# EAGLE board Domino Qi Mini (EAGLE 6.5.0)
DATE: 20150428; DRAWN: M.STEMPIN; REV: E
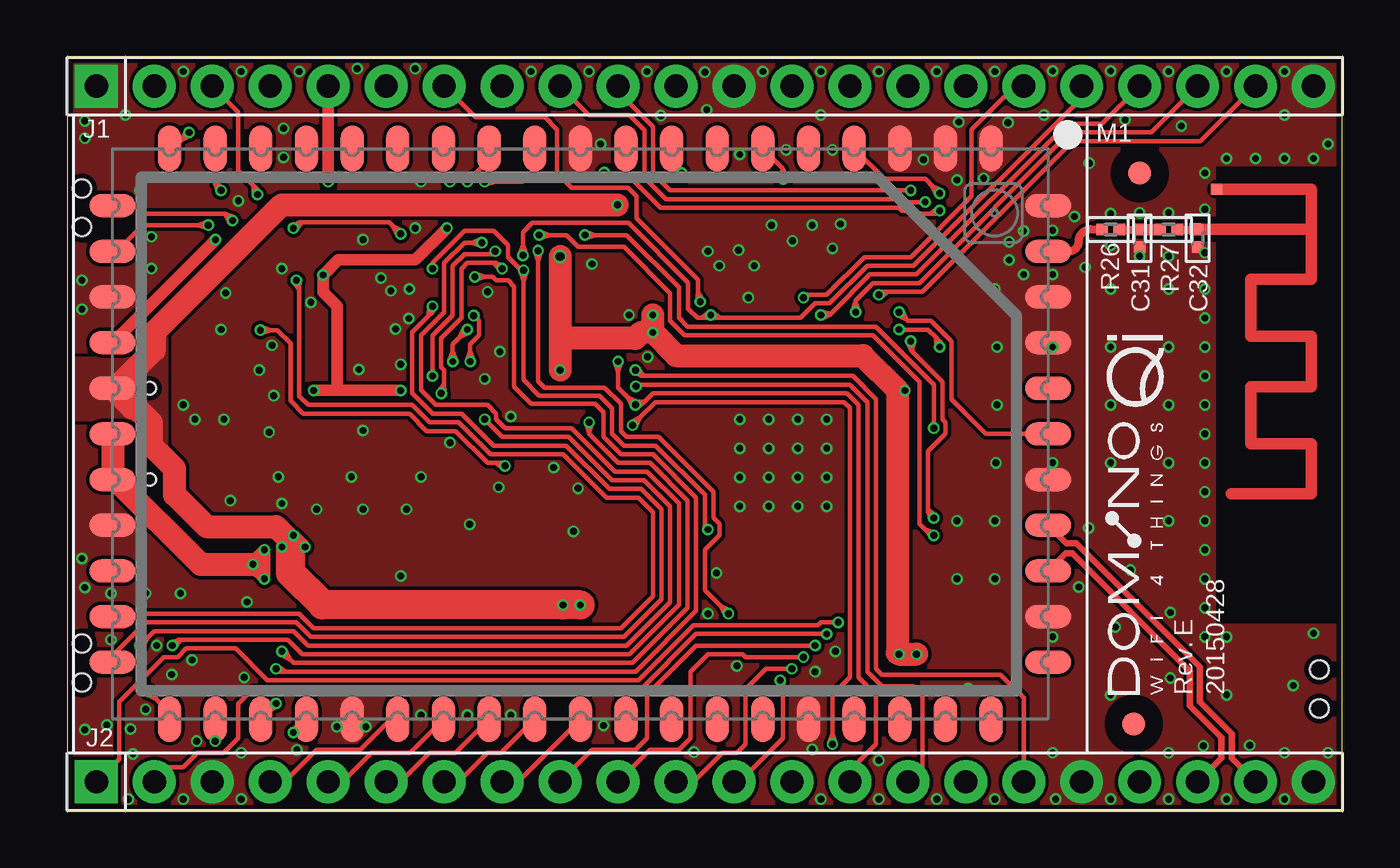
[diagram p1: board, top side]
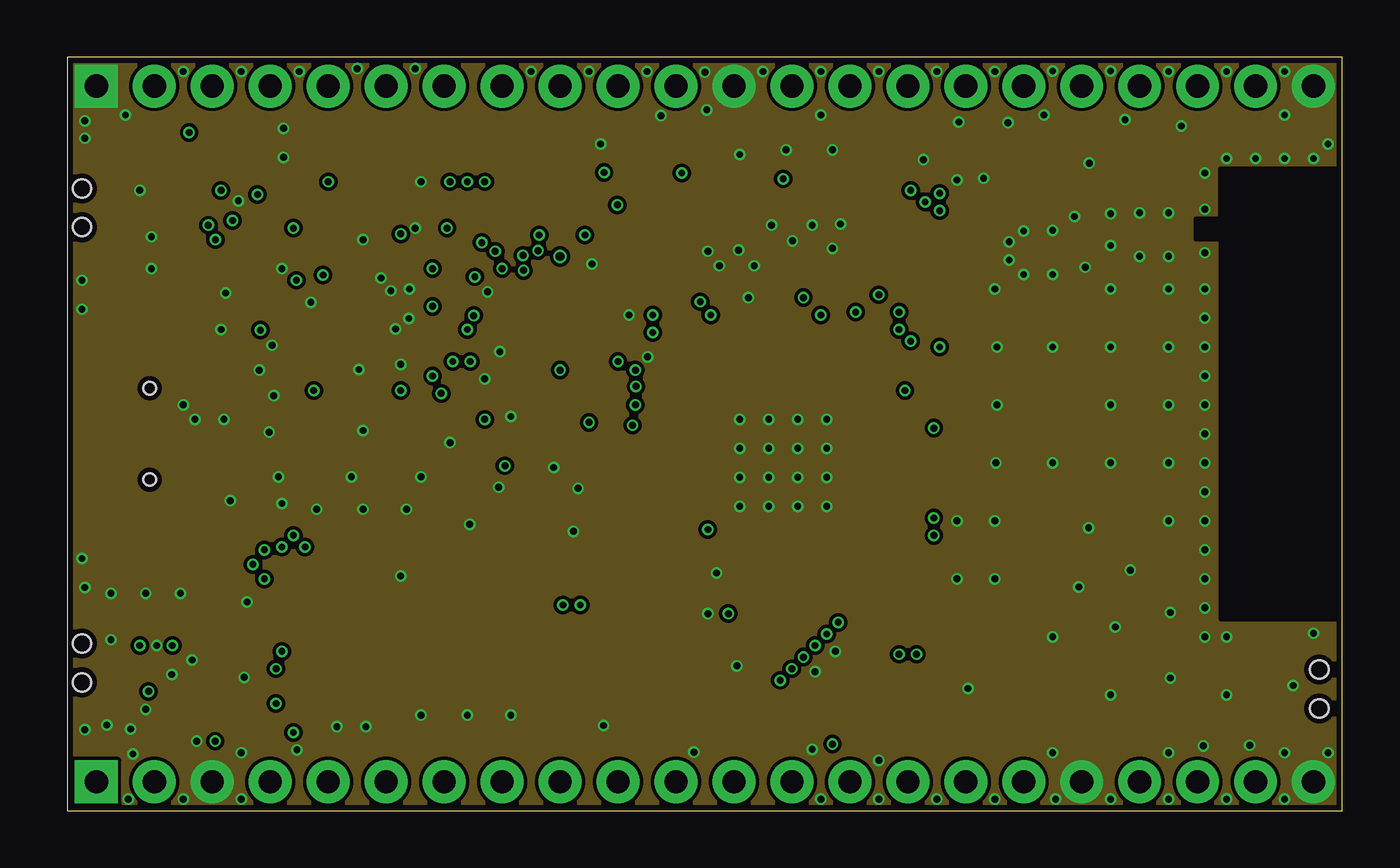
[diagram p2: board, inner layer Route2]
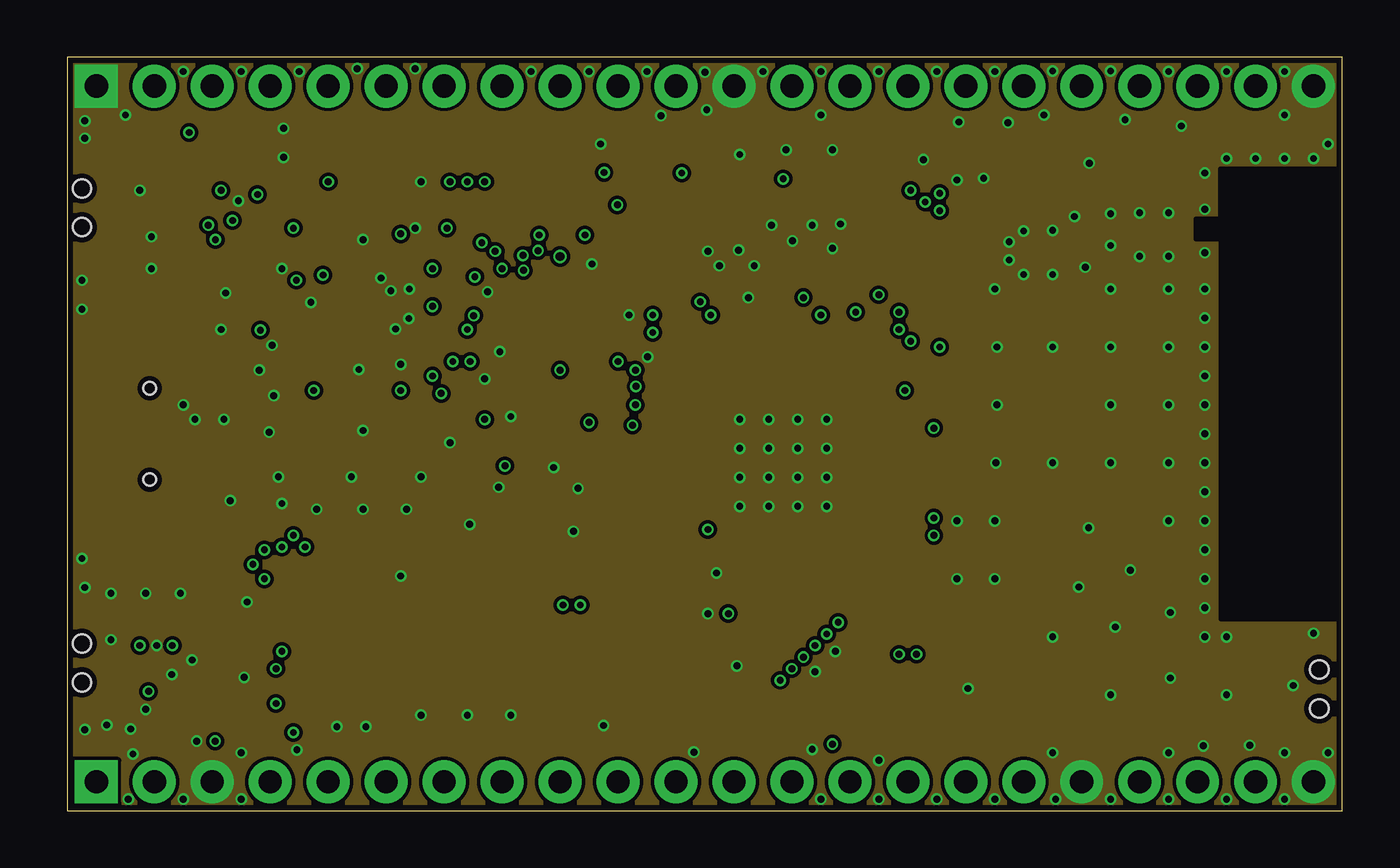
[diagram p3: board, inner layer Route15]
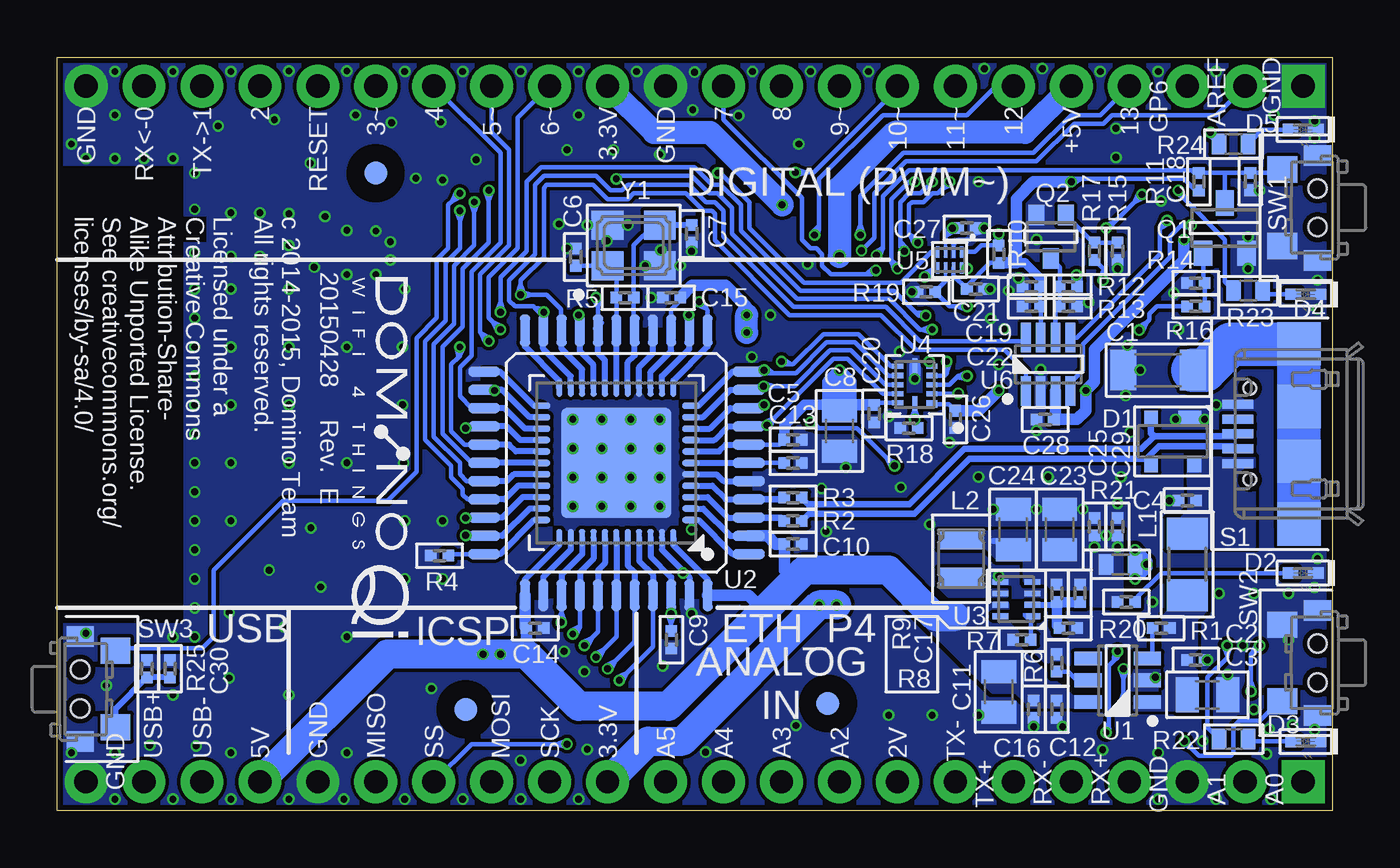
[diagram p4: board, bottom side, seen from below]

Size 55.88 x 33.02 mm. Coordinates in mm from the lower left corner, seen from the top.
Outline: 0,0 55.88,0 55.88,33.02 0,33.02 0,0
Copper layers (1+2*15+16): Top 0.043mm / dielectric 0.3mm / Route2 0.035mm / dielectric 0.71mm / Route15 0.035mm / dielectric 0.3mm / Bottom 0.043mm
Design rules "Domino4 *": minimum track width 0.1mm, minimum drill 0.3mm, track to track 6mil, track to pad 6mil, pad to pad 6mil, via to via 6mil, smd to smd 0mil, copper to edge 0.25mm, drill to drill 0.35mm, minimum pad ring 0.085mm, minimum via ring 0.1mm, stop-mask expansion 0mil, vias tented up to drill 0.45mm, thermal gap 0.2mm
Net classes: 1 USB: width 0.279 mm, clearance 0.152 mm to class 0, clearance 0.152 mm; 2 RF: width 0.356 mm, clearance 0.152 mm; 3 Ethernet: width 0.203 mm, clearance 0.152 mm to class 0, clearance 0.152 mm to class 1, clearance 0.152 mm to class 2, clearance 0.152 mm

## Footprints (pad centres in the part's own frame; a part is rotated, then mirrored left to right if it is on the bottom)
RF_ANT1 = smd 0.5 x 0.5: FEED 1.75,-0.44; GND 0,0.5
C1206 = smd 1.143 x 1.778: 1 -1.524,0; 2 1.524,0
C0402 = smd 0.508 x 0.508: 1 -0.381,0; 2 0.381,0
C0805 = smd 1.016 x 1.524: 1 -0.889,0; 2 0.889,0
SOT143B = smd 1 x 0.7: 1 -0.75,-1 | smd 0.6 x 0.7: 2 0.95,-1; 3 0.95,1; 4 -0.95,1
LED0402 = smd 0.7 x 0.5: 1 -0.55,0; 2 0.55,0
FIDUCIAL = smd 1.016 x 1.016: 1 0,0
MH22-1-0.1 = drill 1.016 pad 1.88 square: 1 0,0 | drill 1.016 pad 1.88: 2 2.54,0; 3 5.08,0; 4 7.62,0; 5 10.16,0; 6 12.7,0; 7 15.24,0; 8 17.78,0; 9 20.32,0; 10 22.86,0; 11 25.4,0; 12 27.94,0; 13 30.48,0; 14 33.02,0; 15 35.56,0; 16 38.1,0; 17 40.64,0; 18 43.18,0; 19 45.72,0; 20 48.26,0; 21 50.8,0; 22 53.34,0
FB1206 = smd 1.4 x 1.8: 1 -1.35,0; 2 1.35,0
SWPA252012S = smd 2 x 0.85: 1 0,0.825; 2 0,-0.825
DOMINO = smd 2 x 1: 1 -12.5,18; 2 -12.5,16; 3 -12.5,14; 4 -12.5,12; 5 -12.5,10; 6 -12.5,8; 7 -12.5,6; 8 -12.5,4; 9 -12.5,2; 10 -12.5,0; 11 -12.5,-2; 12 -12.5,-4; 13 -12.5,-6; 14 -12.5,-8; 15 -12.5,-10; 16 -12.5,-12; 17 -12.5,-14; 18 -12.5,-16; 19 -12.5,-18; 31 12.5,-18; 32 12.5,-16; 33 12.5,-14; 34 12.5,-12; 35 12.5,-10; 36 12.5,-8; 37 12.5,-6; 38 12.5,-4; 39 12.5,-2; 40 12.5,0; 41 12.5,2; 42 12.5,4; 43 12.5,6; 44 12.5,8; 45 12.5,10; 46 12.5,12; 47 12.5,14; 48 12.5,16; 49 12.5,18 | smd 1 x 2: 20 -10,-20.5; 21 -8,-20.5; 22 -6,-20.5; 23 -4,-20.5; 24 -2,-20.5; 25 0,-20.5; 26 2,-20.5; 27 4,-20.5; 28 6,-20.5; 29 8,-20.5; 30 10,-20.5; 50 10,20.5; 51 8,20.5; 52 6,20.5; 53 4,20.5; 54 2,20.5; 55 0,20.5; 56 -2,20.5; 57 -4,20.5; 58 -6,20.5; 59 -8,20.5; 60 -10,20.5
SOT23-3 = smd 0.8 x 1.1: 1 -0.95,-1.1; 2 0.95,-1.1; 3 0,1.1
SOT323 = smd 0.7 x 0.9: 1 -0.65,-0.95; 2 0.65,-0.95; 3 0,0.95
R0402 = smd 0.508 x 0.508: 1 -0.381,0; 2 0.381,0
R0603 = smd 0.635 x 0.889: 1 -0.635,0; 2 0.635,0
USB-MR5-001 = smd 0.4 x 1.35: 1 -1.3,2.675; 2 -0.65,2.675; 3 0,2.675; 4 0.65,2.675; 5 1.3,2.675 | smd 1.9 x 1.9: SH$1 -3.95,0; SH$2 -1.2,0; SH$3 1.2,0; SH$4 3.95,0 | hole 0.55: -2,2.15; 2,2.15
IT-1210 = smd 1.15 x 1.3: 1 -1.675,-1.55; 2 1.675,-1.55 | smd 0.9 x 1.2: SH$1 -2.3,0; SH$2 2.3,0 | hole 0.8: -0.85,0; 0.85,0
SOT23-6 = smd 0.6 x 1.2: 1 -0.95,-1.3; 2 0,-1.3; 3 0.95,-1.3; 4 0.95,1.3; 5 0,1.3; 6 -0.95,1.3
ATMEGA32U4_DUAL_FOOTPRINT = smd 1.4 x 0.45: 1A -5.8,4; 2A -5.8,3.2; 3A -5.8,2.4; 4A -5.8,1.6; 5A -5.8,0.8; 6A -5.8,0; 7A -5.8,-0.8; 8A -5.8,-1.6; 9A -5.8,-2.4; 10A -5.8,-3.2; 11A -5.8,-4; 23A 5.8,-4; 24A 5.8,-3.2; 25A 5.8,-2.4; 26 5.8,-1.6; 27A 5.8,-0.8; 28A 5.8,0; 29A 5.8,0.8; 30A 5.8,1.6; 31A 5.8,2.4; 32A 5.8,3.2; 33A 5.8,4 | smd 0.75 x 0.275: 1M -3.275,2.5; 2M -3.275,2; 3M -3.275,1.5; 4M -3.275,1; 5M -3.275,0.5; 6M -3.275,0; 7M -3.275,-0.5; 8M -3.275,-1; 9M -3.275,-1.5; 10M -3.275,-2; 11M -3.275,-2.5; 23M 3.275,-2.5; 24M 3.275,-2; 25M 3.275,-1.5; 26M 3.275,-1; 27M 3.275,-0.5; 28M 3.275,0; 29M 3.275,0.5; 30M 3.275,1; 31M 3.275,1.5; 32M 3.275,2; 33M 3.275,2.5 | smd 0.45 x 1.4: 12A -4,-5.8; 13A -3.2,-5.8; 14A -2.4,-5.8; 15A -1.6,-5.8; 16A -0.8,-5.8; 17A 0,-5.8; 18A 0.8,-5.8; 19A 1.6,-5.8; 20A 2.4,-5.8; 21A 3.2,-5.8; 22A 4,-5.8; 34A 4,5.8; 35A 3.2,5.8; 36A 2.4,5.8; 37A 1.6,5.8; 38A 0.8,5.8; 39A 0,5.8; 40A -0.8,5.8; 41A -1.6,5.8; 42A -2.4,5.8; 43A -3.2,5.8; 44A -4,5.8 | smd 0.275 x 0.75: 12M -2.5,-3.275; 13M -2,-3.275; 14M -1.5,-3.275; 15M -1,-3.275; 16M -0.5,-3.275; 17M 0,-3.275; 18M 0.5,-3.275; 19M 1,-3.275; 20M 1.5,-3.275; 21M 2,-3.275; 22M 2.5,-3.275; 34M 2.5,3.275; 35M 2,3.275; 36M 1.5,3.275; 37M 1,3.275; 38M 0.5,3.275; 39M 0,3.275; 40M -0.5,3.275; 41M -1,3.275; 42M -1.5,3.275; 43M -2,3.275; 44M -2.5,3.275 | smd 4.826 x 4.826: PAD 0,0
QFN-8_2X1.5 = smd 0.6 x 0.25: 1 -0.75,0.75 | smd 0.7 x 0.25: 2 -0.7,0.25; 3 -0.7,-0.25; 4 -0.7,-0.75; 5 0.7,-0.75; 6 0.7,-0.25; 7 0.7,0.25; 8 0.7,0.75
XQFN-12 = smd 0.5 x 0.32: 1 -0.75,0.85 | smd 0.5 x 0.22: 2 -0.75,0.4; 3 -0.75,0; 4 -0.75,-0.4; 5 -0.75,-0.8; 7 0.75,-0.8; 8 0.75,-0.4; 9 0.75,0; 10 0.75,0.4; 11 0.75,0.8 | smd 0.22 x 0.65: 6 0,-0.825; 12 0,0.825
SOT1089 = smd 0.15 x 0.5: 1 -0.525,-0.35; 2 -0.175,-0.35; 3 0.175,-0.35; 4 0.525,-0.35; 5 0.525,0.35; 6 0.175,0.35; 7 -0.175,0.35; 8 -0.525,0.35
SOT23-8 = smd 0.42 x 1.3: 1 -0.975,-1.175; 2 -0.325,-1.175; 3 0.325,-1.175; 4 0.975,-1.175; 5 0.975,1.175; 6 0.325,1.175; 7 -0.325,1.175; 8 -0.975,1.175
CRYSTAL_32X25 = smd 1.27 x 1.397: 1 -0.889,1.143; 2 -0.889,-1.143; 3 0.889,-1.143; 4 0.889,1.143

## Placement (x,y rotation side)
A1  RF_ANT1  [RF_ANT1]  49.86,27.23 270 top
C1  1n  [C1206]  7.62,19.3 180 bottom
C2  100n  [C0402]  5.97,6.6 0 bottom
C3  4u7  [C0805]  5.46,5.08 0 bottom
C4  10n  [C0402]  6.35,13.59 180 bottom
C5  10u  [C0402]  23.62,16.26 0 bottom
C6  20p  [C0402]  33.15,24.26 270 bottom
C7  20p  [C0402]  28.07,25.27 90 bottom
C8  2u2  [C0805]  21.59,16.64 270 bottom
C9  100n  [C0402]  28.96,7.49 270 bottom
C10  100n  [C0402]  23.62,11.68 0 bottom
C11  22u  [C0805]  14.61,5.21 270 bottom
C12  10p  [C0402]  12.06,4.45 270 bottom
C13  1u  [C0402]  23.62,15.24 180 bottom
C14  100n  [C0402]  34.92,8 0 bottom
C15  100n  [C0402]  28.96,22.48 180 bottom
C16  100n  [C0402]  13.08,4.45 270 bottom
C17  22p  [C0402]  11.05,9.53 90 bottom
C18  100n  [C0402]  3.58,27.57 270 bottom
C19  1u  [C0402]  13.18,22.96 0 bottom
C20  100n  [C0402]  20.07,17.4 270 bottom
C21  100n  [C0402]  15.62,22.86 0 bottom
C22  100n  [C0402]  13.18,22.1 180 bottom
C23  22u  [C0805]  11.94,12.32 90 bottom
C24  22u  [C0805]  13.97,12.32 90 bottom
C25  10p  [C0402]  10.41,12.45 90 bottom
C26  100n  [C0402]  16.51,17.14 270 bottom
C27  100n  [C0402]  16,25.53 0 bottom
C28  100n  [C0402]  12.57,17.14 180 bottom
C29  100n  [C0402]  9.4,12.45 90 bottom
C30  10n  [C0402]  50.93,6.22 90 bottom
C31  DNP  [C0402]  46.99,25.08 270 top
C32  DNP  [C0402]  49.53,25.08 270 top
CC-BY-SA  CC-BY-SA_LOGO  [CC-BY-SA_LOGO]  10.16,-49.53 0 top  (outside the outline)
D1  PRTR5V0U2X  [SOT143B]  6.99,16.18 180 bottom
D2  GREEN  [LED0402]  1.27,10.41 180 bottom
D3  YELLOW  [LED0402]  1.15,3.04 180 bottom
D4  WHITE  [LED0402]  1.15,22.63 180 bottom
D5  BLUE  [LED0402]  1.27,29.84 180 bottom
DRILEGEND  [DRILEGEND]  96.77,62.48 0 top  (outside the outline)
F1  FIDUCIAL  [FIDUCIAL]  22.1,4.7 180 bottom
F2  FIDUCIAL  [FIDUCIAL]  46.74,3.81 0 top
F3  FIDUCIAL  [FIDUCIAL]  46.99,27.94 0 top
F4  FIDUCIAL  [FIDUCIAL]  37.97,4.45 0 bottom
F5  FIDUCIAL  [FIDUCIAL]  41.91,27.94 0 bottom
J1  MH22-1  [MH22-1-0.1]  1.27,31.75 0 top
J2  MH22-1  [MH22-1-0.1]  1.27,1.27 0 top
L1  BLM31PG601SN1L  [FB1206]  6.35,10.79 90 bottom
L2  SWPA252012S1R0NT  [SWPA252012S]  16.26,11.05 180 bottom
M1  DOMINO  [DOMINO]  22.48,16.51 270 top
Q1  AP2302GN  [SOT23-3]  4.7,25.53 0 bottom
Q2  2SC4081  [SOT323]  12.32,25.15 180 bottom
R1  100k  [R0402]  7.49,8 0 bottom
R2  22R  [R0402]  23.62,12.7 180 bottom
R3  22R  [R0402]  23.62,13.72 180 bottom
R4  10k  [R0402]  39.12,11.18 0 bottom
R5  1M  [R0402]  30.99,22.48 180 bottom
R6  15k  [R0402]  12.06,6.48 90 bottom
R7  10k  [R0402]  13.59,7.49 0 bottom
R8  33k2  [R0402]  11.56,8 180 bottom
R9  150k  [R0402]  12.06,9.53 270 bottom
R10  10k  [R0402]  14.61,24.38 270 bottom
R11  4k7  [R0402]  5.84,27.56 90 bottom
R12  10k  [R0402]  11.56,22.96 0 bottom
R13  10k  [R0402]  11.56,22.1 0 bottom
R14  4k7  [R0402]  5.97,23.11 180 bottom
R15  47k  [R0402]  9.4,24.51 270 bottom
R16  1k  [R0402]  5.97,22.1 0 bottom
R17  47k  [R0402]  10.41,24.51 270 bottom
R18  10k  [R0402]  18.54,16.76 0 bottom
R19  10k  [R0402]  17.78,22.73 0 bottom
R20  270R  [R0402]  9.02,9.14 180 bottom
R21  0R  [R0603]  9.27,10.79 0 bottom
R22  330R  [R0603]  4.31,3.14 180 bottom
R23  330R  [R0603]  3.67,22.79 180 bottom
R24  270R  [R0603]  4.32,29.21 180 bottom
R25  10k  [R0402]  51.94,6.22 270 bottom
R26  0R  [R0402]  45.72,25.46 0 top
R27  0R  [R0402]  48.26,25.46 0 top
S1  USB_MR5-001  [USB-MR5-001]  1.45,16.51 90 bottom
SW1  IT-1210  [IT-1210]  0.64,26.42 270 bottom
SW2  IT-1210  [IT-1210]  0.64,6.48 270 bottom
SW3  IT-1210  [IT-1210]  54.86,5.33 90 bottom
U1  MP65151DJ  [SOT23-6]  9.4,5.71 90 bottom
U2  ATMEGA32U4-AU/MU  [ATMEGA32U4_DUAL_FOOTPRINT]  31.37,15.24 180 bottom
U3  MP2162GQH  [QFN-8_2X1.5]  13.84,9.27 180 bottom
U4  NTB0104GU12  [XQFN-12]  18.29,18.67 180 bottom
U5  NTB0102GF  [SOT1089]  16.76,24.13 180 bottom
U6  MAX3375EEKA+T  [SOT23-8]  12.45,19.56 0 bottom
U$3  [DOMINO_QI_LOGO_SMALL]  46.99,5.08 90 top
U$5  [DOMINO_QI_LOGO_SMALL]  41.91,23.37 270 bottom
U$28  [A5L-LOC]  -40.64,-60.96 0 top  (outside the outline)
W1  DOMINO_QI_LOGO  [DOMINO_QI_LOGO]  -34.29,-46.99 0 top  (outside the outline)
Y1  16MHz  [CRYSTAL_32X25]  30.61,24.77 90 bottom

## Tracks (layer width: path | path; a pad name or v marks a point on that pad's centre or on a via)
!RESET  (via drill 0.3)
  Top 0.203: J1.18 44.45,31.24 37.08,23.88 35.05,23.88 33.4,22.23 32.77,22.23 32.13,21.59 28.63,21.59 | 28.63,21.59 28.32,21.59 v28.19,21.72 | v19.96,24.33 19.96,24.78 | 19.96,24.78 19.96,25.35 20.37,25.76 24.59,25.76 27.2,23.14 27.2,22 27.61,21.59 27.76,21.59 | 27.76,21.59 28.07,21.59 v28.19,21.72 | 28.63,21.59 28.28,21.84 v28.19,21.72 | 28.63,21.59 28.2,21.57 v28.19,21.72 | 27.76,21.59 28.19,21.57 v28.19,21.72 | 27.76,21.59 28.11,21.84 v28.19,21.72 | 19.96,24.78 19.82,24.38 v19.96,24.33 | 19.96,24.78 20.1,24.38 v19.96,24.33
  Bottom 0.203: 4.7,27.95 C18.1 2.33,27.95 SW1.1 | 4.7,27.95 R11.2 6.02,27.94 6.15,28.07 18.54,28.07 19.68,26.92 19.68,24.69 | Q1.3 4.7,27.95 | 19.68,24.69 19.68,24.61 v19.96,24.33 | U2.13A 28.17,21.27 | 28.17,21.27 28.17,21.69 v28.19,21.72 | 28.17,21.27 28.33,21.66 v28.19,21.72 | 28.17,21.27 28.05,21.68 v28.19,21.72 | 19.68,24.69 19.82,24.29 v19.96,24.33 | 19.68,24.69 20.04,24.46 v19.96,24.33
!RESET_L  (via drill 0.3)
  Top 0.203: 37.91,27.37 37.59,27.69 35.8,27.69 M1.4 | 37.91,27.37 v38.23,27.05 | 37.91,27.37 38.09,26.99 v38.23,27.05 | 37.91,27.37 38.29,27.18 v38.23,27.05
  Bottom 0.203: SW3.2 53.21,7.11 49.53,7.11 49.02,7.62 49.02,10.54 45.97,13.59 41.4,13.59 40.13,14.86 40.13,20.7 39.24,21.59 39.24,24.13 38.73,24.64 38.73,26.54 38.55,26.73 | v38.23,27.05 38.55,26.73 | 38.55,26.73 38.36,27.11 v38.23,27.05 | 38.55,26.73 38.16,26.92 v38.23,27.05
!UART_EN
  Bottom 0.203: Q2.3 11.94,23.82 R12.1 R13.1 12.12,21.91 U6.6
+2V5  (via drill 0.3)
  Top 0.508: M1.23 v6.49,25.02 | 11.81,18.41 11.81,22.1 11.2,22.71 v11.2,23.47 11.86,24.13 15.24,24.13 v16.64,25.53 | 11.81,18.41 v14.61,18.41 | 11.81,18.41 v10.79,18.41
  Bottom 0.152: U5.3 16.94,24.97
  Bottom 0.203: U4.1 16.8,17.82 C26.1 | v16.64,25.53 16.94,25.23 16.94,25.19 | v16.64,25.53 C27.1 | 16.94,24.97 16.94,25.19 | 16.94,25.19 16.77,25.59 v16.64,25.53 | 16.94,25.19 16.57,25.4 v16.64,25.53
  Bottom 0.508: v6.49,25.02 6.49,24.12 10.41,20.19 10.41,18.8 v10.79,18.41 10.79,17.53 11.18,17.14 12.12,17.14 12.12,17.22 | U6.3 12.12,17.22 | 12.12,17.22 C28.1 | v14.61,18.41 15.49,17.53 C26.1 | R12.2 11.18,23.44 v11.2,23.47
+2VA_ETH_OUT
  Top 0.203: M1.40 19.74,1.27 J2.8
+3.3VD_IN  (via drill 0.3)
  Top 0.508: v8.13,10.79 8.13,10.92 v8.64,11.43 v8.64,10.16 8.13,10.67 v8.13,10.79
  Top 1.016: M1.25 M1.26 | M1.26 1.68,14.51 | M1.26 2.13,14.51 5.84,10.79 v8.13,10.79
  Bottom 0.508: v8.64,11.43 R21.2 v8.64,10.16 8.13,10.67 v8.13,10.79 8.13,10.92 v8.64,11.43
+3V3  (via drill 0.3)
  Top 0.508: v9.4,11.56 9.78,11.56 v10.41,11.56 v9.91,12.06 9.72,11.87 v9.4,11.56
  Top 0.762: M1.24 2.13,18.51
  Top 1.016: M1.24 2.84,17.65 3.02,17.65 3.68,16.99 3.68,16 4.7,14.99 4.7,13.84 6.1,12.45 9.14,12.45 9.72,11.87 | 2.13,18.51 3.81,20.19 3.81,20.95 9.4,26.54 v24.11,26.54
  Top 1.27: v22.48,9.02 v21.72,9.02 11.18,9.02 9.78,10.41 9.78,11.56
  Bottom 0.254: C24.1 14.22,11.68 14.48,11.68 14.61,11.81 14.86,11.81
  Bottom 0.61: 12.06,11.3 C23.1
  Bottom 1.016: J1.13 29.72,29.72 27.25,29.72 24.11,26.57 v24.11,26.54
  Bottom 1.27: J2.13 29.97,3.05 28.45,3.05 v22.48,9.02 v21.72,9.02
  pour Bottom (no thermals): 13.39,10.03 13.39,10.06 13.41,10.06 13.41,11.05 14.63,11.05 15.14,11.56 17.12,11.56 17.12,12.17 15.14,12.17 14.78,12.19 9.27,12.19 9.27,9.02 10.52,9.02 10.52,9.78 12.27,9.78 12.5,10.03
  pour Top (no thermals): 0,19.81 2.92,19.81 3.68,20.7 4.32,20.7 4.32,16 3.3,16 3.3,16.89 3.05,17.14 0,17.14
+5V  (via drill 0.3, 0.38)
  Top 0.508: 36.37,18.44 36.68,18.44 v36.7,18.41 | v11.43,27.56 J1.5
  Top 1.016: v37.21,6.86 v36.45,6.86 36.4,6.91 36.37,6.91 36.37,18.44 | 36.39,18.41 36.37,18.44 | 36.37,18.44 34.87,19.94 26.67,19.94 v25.65,20.95 | v21.59,24.28 21.59,20.83 | 21.59,20.83 v21.59,19.3 | v25.65,20.95 v25.65,21.72 | v25.65,20.95 25.15,20.95 24.89,20.7 21.72,20.7 21.59,20.83
  Bottom 0.203: 13.84,7.62 R7.1 | U2.14A 28.97,21.96 28.57,22.35 C15.1 | U2.7A 24.22,16.04 C5.1 | U4.11 19.98,17.87 C20.1 | R11.1 5.99,27.18 6.5,27.69 11,27.69 | 12.77,22.93 C19.2 C22.1 12.77,22.07 U6.7 | 11,27.69 11.3,27.69 v11.43,27.56 | R10.2 14.99,24 16,22.99 C21.1 16.59,23.45 U5.7 | 11,27.69 11.34,27.44 v11.43,27.56 | 11,27.69 11.42,27.71 v11.43,27.56
  Bottom 0.254: v36.7,18.41 36.68,18.44 36.37,18.44
  Bottom 0.406: C19.2 12.8,23.34 13.46,24 13.84,24
  Bottom 0.457: 22.1,17.78 23.11,17.78 24,16.89 C5.1
  Bottom 0.508: U2.2A 24.74,12.04 24.38,11.68 C10.1 24,10.54 23.11,10.54 | U2.34A 35.37,8.06 C14.1 35.31,6.86 | U2.44A 25.57,9.44 24.89,8.76 | C20.1 21.08,17.78 21.08,18.8 v21.59,19.3 | v11.43,27.56 13.08,27.56 13.84,26.8 13.84,24 R10.2 | C15.1 28.04,23.01 26.59,23.01 25.65,22.07 v25.65,21.72 | v21.59,19.3 22.1,18.8 22.1,18.03 | 22.1,18.03 21.59,18.03 | 21.59,18.03 v21.59,19.3 | 21.59,18.03 C8.1 | 22.1,18.03 22.1,17.78
  Bottom 1.016: J1.5 13.46,29.72 19.18,29.72 21.59,27.3 v21.59,24.28 | v25.65,20.95 v25.65,21.72
  Bottom 1.27: J2.19 41.4,6.86 v36.45,6.86 35.31,6.86 33.02,4.57 29.08,4.57 24.89,8.76 23.11,10.54 19.43,10.54 17.4,8.51 16.51,8.51
  pour Bottom (no thermals): 13.82,7.24 13.82,7.82 14.22,8.23 14.22,9.04 18.69,9.04 14.86,5.21 13.84,5.21 13.36,4.72 13.36,4.57 10.16,4.57 10.16,4.95 11.18,4.95 11.18,4.98 11.2,4.98 11.33,4.95 12.57,5.99
A0  (via drill 0.3)
  Top 0.203: v33.78,8.26 33.02,8.26 32.89,8.13 27.43,8.13 25.02,5.71 8.76,5.71 7.37,7.11 5.21,7.11 4.83,6.73 4.22,6.73 2.26,4.78 2.26,2.26 J2.1
  Bottom 0.203: v33.78,8.26 33.77,8.27 33.77,8.71 | U2.36A 33.77,8.71 | 33.77,8.71 33.64,8.3 v33.78,8.26 | 33.77,8.71 33.92,8.31 v33.78,8.26
A1  (via drill 0.3)
  Top 0.203: v33.27,7.75 27.56,7.75 25.15,5.33 8.13,5.33 7.49,4.7 7.49,3.17 6.86,2.54 5.71,2.54 5.08,1.91 4.45,1.91 J2.2
  Bottom 0.203: U2.37A 32.97,8.08 | 32.97,8.08 32.97,8.05 v33.27,7.75 | 32.97,8.08 33.14,7.69 v33.27,7.75 | 32.97,8.08 33.34,7.88 v33.27,7.75
A2  (via drill 0.3)
  Top 0.203: v32.77,7.24 27.56,7.24 25.4,5.08 25.4,3.17 24.89,2.67 22.99,2.67 J2.9
  Bottom 0.203: U2.38A 32.17,7.84 32.45,7.56 | 32.45,7.56 v32.77,7.24 | 32.45,7.56 32.63,7.17 v32.77,7.24 | 32.45,7.56 32.83,7.37 v32.77,7.24
A3  (via drill 0.3)
  Top 0.203: v32.26,6.73 29.72,6.73 29.59,6.86 28.07,6.86 27.3,6.1 27.3,3.17 26.8,2.67 25.53,2.67 J2.10
  Bottom 0.203: U2.39A 31.37,7.62 31.94,7.05 | 31.94,7.05 v32.26,6.73 | 31.94,7.05 32.12,6.67 v32.26,6.73 | 31.94,7.05 32.32,6.87 v32.26,6.73
A4  (via drill 0.3)
  Top 0.203: v31.75,6.22 30.61,6.22 29.72,5.33 29.72,2.92 29.34,2.54 28.7,2.54 27.43,1.27 J2.11
  Bottom 0.203: U2.40A 30.57,7.4 31.43,6.54 | 31.43,6.54 v31.75,6.22 | 31.43,6.54 31.62,6.16 v31.75,6.22 | 31.43,6.54 31.81,6.36 v31.75,6.22
A5  (via drill 0.3)
  Top 0.203: 31.37,5.28 31.37,3.17 29.46,1.27 J2.12 | 31.37,5.28 31.37,5.59 v31.24,5.71 | 31.37,5.28 31.39,5.71 v31.24,5.71 | 31.37,5.28 31.12,5.63 v31.24,5.71
  Bottom 0.203: U2.41A 29.77,7.19 30.92,6.03 | 30.92,6.03 v31.24,5.71 | 30.92,6.03 31.11,5.65 v31.24,5.71 | 30.92,6.03 31.31,5.85 v31.24,5.71
ANT0
  Top 0.356: M1.59 43.94,24.51 arc90 44.32,25.02 arc-90 44.9,25.46 R26.1
  Top 0.66: M1.59 42.55,24.51
ANT0_50R
  Top 0.356: R27.2 C32.1
  Top 0.508: C32.1 49.41,25.46 arc90 A1.FEED
ANT0_EXT
  Top 0.356: R26.2 C31.1
  Top 0.508: C31.1 R27.1
AREF  (via drill 0.3)
  Top 0.203: v28.97,8.64 28.65,8.95 | 28.65,8.95 27.94,9.66 27.94,11.43 28.57,12.06 28.57,12.57 28.32,12.83 28.32,13.97 25.91,16.38 24.51,16.38 24.26,16.64 24.26,17.83 23.55,18.54 20.9,18.54 20.62,18.82 20.62,24.09 | v20.62,24.54 20.62,24.09 | 28.65,8.95 28.84,8.57 v28.97,8.64 | 28.65,8.95 29.03,8.77 v28.97,8.64 | 20.62,24.09 20.77,24.49 v20.62,24.54 | 20.62,24.09 20.48,24.49 v20.62,24.54
  Bottom 0.203: v28.97,8.64 28.97,8.19 | 28.97,8.19 28.97,7.89 C9.1 | v28.97,8.64 28.97,9.09 | 28.97,9.09 U2.42A | J1.2 5.08,30.48 9.65,30.48 10.03,30.1 11.3,30.1 12.95,28.45 18.67,28.45 20.07,27.05 20.07,25.09 v20.62,24.54 | 28.97,8.19 29.11,8.59 v28.97,8.64 | 28.97,8.19 28.83,8.59 v28.97,8.64 | 28.97,9.09 28.83,8.69 v28.97,8.64 | 28.97,9.09 29.11,8.69 v28.97,8.64
BLUE_LED
  Bottom 0.203: D5.2 3.05,29.84 R24.1
BLUE_LED1
  Bottom 0.203: D4.2 2.87,22.63 R23.1
BLUE_LED2
  Bottom 0.203: D3.2 3.57,3.04 R22.1
D4
  Bottom 0.203: U2.25A 37.71,17.64 38.23,18.16 38.23,19.43 37.72,19.94 37.72,23.62 36.45,24.89 36.45,28.83 J1.16
D5  (via drill 0.3)
  Top 0.203: v37.97,12.83 37.72,13.08 37.72,13.2 | 37.72,13.2 37.72,15.75 38.48,16.51 38.48,17.02 38.35,17.14 38.35,18.8 37.02,20.13 | 37.02,20.13 36.96,20.19 v36.96,20.57 | 37.02,20.13 37.1,20.55 v36.96,20.57 | 37.02,20.13 36.83,20.51 v36.96,20.57 | 37.72,13.2 37.83,12.79 v37.97,12.83 | 37.72,13.2 38.06,12.95 v37.97,12.83
  Bottom 0.203: v37.97,12.83 37.52,12.83 | 37.52,12.83 37.18,12.83 U2.31A | v36.96,20.57 37.27,20.89 | 37.27,20.89 37.34,20.95 37.34,23.5 36.07,24.77 36.07,28.96 36.83,29.72 J1.15 | 37.27,20.89 36.89,20.71 v36.96,20.57 | 37.27,20.89 37.09,20.51 v36.96,20.57 | 37.52,12.83 37.92,12.69 v37.97,12.83 | 37.52,12.83 37.92,12.97 v37.97,12.83
D6  (via drill 0.3)
  Top 0.203: v38.23,20.32 38.23,20.57 38.06,20.74 | 38.06,20.74 37.72,21.08 v36.45,21.08 | 38.06,20.74 38.08,20.31 v38.23,20.32 | 38.06,20.74 38.34,20.42 v38.23,20.32
  Bottom 0.203: v36.45,21.08 36.77,21.4 | 36.77,21.4 36.96,21.59 36.96,23.37 35.69,24.64 35.69,30.35 J1.14 | U2.27A 38.01,16.04 38.61,16.64 38.61,19.56 38.29,19.88 | 38.29,19.88 38.23,19.94 v38.23,20.32 | 36.77,21.4 36.38,21.22 v36.45,21.08 | 36.77,21.4 36.58,21.02 v36.45,21.08 | 38.29,19.88 38.37,20.29 v38.23,20.32 | 38.29,19.88 38.09,20.25 v38.23,20.32
D+
  Bottom 0.279: R3.1 22.96,13.44 18.52,13.44 16.1,15.85 8.36,15.85 7.8,16.41 | D1.2 7.93,16.55 7.8,16.41 | 4.15,16.48 4.23,16.41 7.8,16.41
  Bottom 0.368: D1.2 7.97,17.18 | 4.15,16.48 S1.3
D-
  Bottom 0.279: R2.1 22.94,13.01 18.31,13.01 15.9,15.42 8.15,15.42 | 7.93,15.33 D1.3 7.93,15.21 8.15,15.42 | 8.15,15.42 7.59,15.98 4.24,15.98 4.15,15.88
  Bottom 0.368: 4.15,15.88 S1.2
EN
  Bottom 0.203: R7.2 13.21,8.41 U3.1
EN_USB
  Bottom 0.203: R1.1 7.87,6.89 U1.3
FB
  Bottom 0.203: 12.19,9.02 R9.2
  Bottom 0.254: U3.2 12.19,9.02
  Bottom 0.457: C17.1 R9.2 12.06,8.13 R8.2
GND  (via drill 0.3)
  Bottom 0.152: U5.2 16.59,24.81
  Bottom 0.203: 30.37,16.24 U2.PAD 32.96,13.65 | 33.37,13.24 v33.27,13.34 | v33.27,13.34 32.96,13.65 | 16.59,24.81 16.38,25.02 15.88,25.02 15.62,25.27 15.62,25.29 | C27.2 15.62,25.29 | 32.96,13.65 33.14,13.27 v33.27,13.34 | 32.96,13.65 33.34,13.47 v33.27,13.34 | 15.62,25.29 15.36,25.62 v15.24,25.53 15.21,25.38 15.62,25.29
  Bottom 0.508: U4.6 v18.29,18.92
  other vias: 45.72,26.16 43.18,25.43 41.91,25.4 41.91,23.5 43.18,23.5 41.27,24.13 41.27,24.92 44.61,23.81 45.72,24.77 46.99,24.29 48.26,24.29 49.85,24.45 49.85,21.59 49.85,20.32 49.85,22.86 49.85,19.05 49.85,17.78 49.85,16.51 49.85,15.24 49.85,13.97 49.85,12.7 49.85,11.43 49.85,10.16 49.85,8.89 49.85,7.62 50.8,7.62 54.61,7.78 55.24,2.54 53.34,2.54 50.8,5.08 48.26,22.86 48.26,20.32 48.26,17.78 48.26,15.24 48.26,12.7 48.34,8.69 45.72,5.08 45.92,8.05 44.75,12.4 45.72,15.24 45.72,17.78 45.72,20.32 45.72,22.86 49.85,27.94 50.8,28.57 52.07,28.57 53.34,28.57 54.61,28.57 55.24,29.21 53.34,30.48 49.85,26.35 48.26,26.19 46.99,26.19 44.13,26.04 8.97,20.4 8.41,19.3 9.04,18.19 2.54,30.48 5.08,17.78 6.73,21.08 7.62,2.54 17.63,12.55 30.86,25.65 33.88,25.7 33.02,30.48 38.99,10.16 38.99,12.7 38.99,27.64 40.64,10.16 40.64,12.7 40.69,15.24 40.74,17.78 40.74,20.32 40.64,22.86 43.18,20.32 43.18,15.24 43.18,7.62 43.18,2.54 48.34,5.82 48.26,2.54 29.46,13.34 30.73,13.34 32,13.34 33.27,14.61 32,14.61 29.46,14.61 29.46,15.88 30.73,15.88 32,15.88 33.27,15.88 33.27,17.14 32,17.14 30.73,17.14 29.46,17.14 29.34,6.35 33.66,6.99 32.77,6.1 15.49,4.19 17.53,4.19 19.43,4.19 1.91,7.49 1.91,9.53 1.73,3.76 0.76,3.56 22.17,12.24 0.76,9.78 0.64,11.05 0.64,23.24 0.64,21.97 3.68,25.15 3.68,23.75 3.17,27.18 0.76,30.23 0.76,29.46 15.24,32.51 12.7,32.51 31.5,28.96 33.53,28.96 37.52,28.52 40.16,27.71 42.8,30.48 46.35,30.28 48.82,30 44.78,28.37 30.48,32.38 33.02,32.38 35.56,32.38 38.1,32.38 48.26,32.38 50.8,32.38 53.34,32.38 22.38,14.12 22.99,23.95 29.84,22.48 28.07,24.51 30.1,23.88 28.57,23.88 33.53,24.64 32.64,25.65 31.78,24.97 18.9,14.17 21.31,15.04 15.49,14.63 12.45,14.63 10.92,13.21 9.4,13.46 9.25,14.63 12.95,13.21 14.86,13.21 14.61,10.29 7.87,9.14 4.95,9.53 3.43,9.53 7.14,13.59 8.84,16.59 6.86,17.14 5.59,17.14 3.43,4.45 2.67,0.51 11.81,3.68 13.08,3.68 33.02,0.51 5.08,0.51 7.62,0.51 35.56,0.51 38.1,0.51 40.64,0.51 43.31,0.51 45.72,0.51 48.26,0.51 50.8,0.51 53.34,0.51 5.46,6.6 7.75,5.84 4.57,5.97 28.45,10.41 28.07,8.64 5.66,3.05 23.37,29.21 12.78,19.33 9.4,23.75 12.95,25.02 10.67,22.28 14.17,22.78 12.95,16.66 13.74,23.34 16.76,16.13 19.43,17.27 14.61,19.56 15.49,27.56 29.41,24.56 18.95,20.12 25.43,19.89 24.61,21.72 6.93,22.68 39.47,5.36 53.72,5.49 46.58,10.54 44.32,9.8 49.78,2.84 51.82,2.87 39.07,30.18 41.22,30.15 29.46,28.75 28.02,30.71 27.94,32.36 43.18,32.41 32.64,2.69 35.56,2.21 27.46,2.57 23.5,3.73 10.06,2.67 3.91,7.24 2.77,3.58 2.87,2.49 7.49,26.72 9.47,28.63 9.47,29.9 25.4,32.38 26.01,30.45 14.96,21.56 14.38,21.11 22.86,32.38 20.32,32.38 10.16,32.38 7.62,32.38 5.08,32.38 40.64,32.38 45.72,32.41 18.41,22.73 14.99,22.86 30.73,14.61
  pour Top (rank 2, no thermals): 0,33.02 55.88,33.02 55.88,0 0,0
  pour Route2 (rank 2, no thermals): 0,33.02 55.88,33.02 55.88,0 0,0
  cutout Route2: 55.73,28.12 50.52,28.12 50.52,25.93 49.45,25.93 49.45,25.04 50.55,25.04 50.55,8.38 55.75,8.38
  pour Route15 (rank 2, no thermals): 0,33.02 55.88,33.02 55.88,0 0,0
  cutout Route15: 55.73,28.12 50.52,28.12 50.52,25.93 49.45,25.93 49.45,25.04 50.55,25.04 50.55,8.38 55.75,8.38
  pour Bottom (rank 2, no thermals): 0,33.02 55.88,33.02 55.88,0 0,0
GP6  (via drill 0.3)
  Top 0.203: J1.3 7.49,30.61 7.49,28.04 8.13,27.4 | v9.91,25.53 10.16,25.78 10.28,25.78 | 10.28,25.78 14.1,25.78 14.29,25.59 | 14.29,25.59 v14.61,25.27 | 8.13,27.4 8.33,27.2 v8.33,27 | 8.13,27.4 8.18,26.98 v8.33,27 | 8.13,27.4 8.44,27.11 v8.33,27 | 10.28,25.78 9.87,25.67 v9.91,25.53 | 10.28,25.78 10.03,25.44 v9.91,25.53 | 14.29,25.59 14.47,25.21 v14.61,25.27 | 14.29,25.59 14.67,25.41 v14.61,25.27
  Bottom 0.152: U5.1 16.23,24.48
  Bottom 0.203: v9.91,25.53 9.8,25.53 9.54,25.79 | 9.54,25.79 8.65,26.68 | 8.65,26.68 v8.33,27 | 14.61,24.82 R10.1 15.37,24.77 15.65,24.48 16.23,24.48 | 14.61,24.82 v14.61,25.27 | 8.65,26.68 8.46,27.07 v8.33,27 | 8.65,26.68 8.27,26.87 v8.33,27 | 9.54,25.79 9.78,25.44 v9.91,25.53 | 9.54,25.79 9.95,25.67 v9.91,25.53 | 14.61,24.82 14.74,25.22 v14.61,25.27 | 14.61,24.82 14.46,25.22 v14.61,25.27
HANDSHAKE  (via drill 0.3)
  Top 0.203: v28.07,12.32 27.94,12.45 27.94,13.84 25.78,16 24.38,16 23.88,16.51 23.88,17.63 23.32,18.19 20.68,18.19 19.99,18.87 19.99,23.22 | 19.99,23.22 v19.99,23.67 | v19.99,23.67 19.89,23.67 19.3,24.26 19.3,24.77 18.67,25.4 17.4,25.4 16,24 v16,23.75 | 19.99,23.22 20.13,23.62 v19.99,23.67 | 19.99,23.22 19.85,23.62 v19.99,23.67
  Bottom 0.152: U5.8 16.03,23.78
  Bottom 0.203: v28.07,12.32 28.07,12.71 U2.1M | J1.11 26.67,30.28 23.24,26.85 23.24,25.02 22.86,24.64 22.61,24.64 22.35,24.38 22.35,23.88 21.97,23.5 20.4,23.5 | 20.4,23.5 20.17,23.5 v19.99,23.67 | v16,23.75 16.03,23.78 | 20.4,23.5 20.09,23.78 v19.99,23.67 | 20.4,23.5 19.98,23.52 v19.99,23.67
I2S_CK  (via drill 0.3)
  Top 0.203: M1.34 10.22,3.75 | 10.22,3.75 v9.91,3.44 v9.91,3.43 | v9.4,6.99 9.72,6.67 | 9.72,6.67 9.91,6.48 24.77,6.48 27.18,8.89 27.18,13.59 25.53,15.24 24.13,15.24 22.86,16.51 22.86,16.57 | 22.86,16.57 v22.86,17.02 | v19.18,15.11 19.05,15.24 18.75,15.24 | 18.75,15.24 18.41,15.24 17.02,16.64 15.75,16.64 14.99,17.4 10.34,17.4 9.78,17.96 9.78,20.47 9.2,21.06 8.91,21.06 | 8.91,21.06 v8.46,21.06 | 10.22,3.75 9.84,3.56 v9.91,3.43 | 10.22,3.75 10.04,3.37 v9.91,3.43 | 9.72,6.67 9.53,7.05 v9.4,6.99 | 9.72,6.67 9.33,6.85 v9.4,6.99 | 8.91,21.06 8.51,21.2 v8.46,21.06 | 8.91,21.06 8.51,20.92 v8.46,21.06 | 22.86,16.57 23,16.97 v22.86,17.02 | 22.86,16.57 22.72,16.97 v22.86,17.02 | 18.75,15.24 19.09,14.99 v19.18,15.11 | 18.75,15.24 19.17,15.26 v19.18,15.11
  Bottom 0.203: v9.91,3.43 9.78,3.56 9.78,3.86 | 9.78,3.86 9.78,6.35 9.56,6.57 | 9.56,6.57 9.4,6.73 v9.4,6.99 | v22.86,17.02 22.61,16.76 22.49,16.76 | 22.49,16.76 20.83,16.76 19.5,15.43 | 19.5,15.43 v19.18,15.11 | R16.1 7.67,22.1 8,21.77 8,21.51 8.14,21.38 | 8.14,21.38 v8.46,21.06 | 9.78,3.86 9.76,3.44 v9.91,3.43 | 9.78,3.86 10.03,3.52 v9.91,3.43 | 9.56,6.57 9.55,6.99 v9.4,6.99 | 9.56,6.57 9.29,6.89 v9.4,6.99 | 8.14,21.38 8.32,20.99 v8.46,21.06 | 8.14,21.38 8.52,21.19 v8.46,21.06 | 22.49,16.76 22.9,16.88 v22.86,17.02 | 22.49,16.76 22.74,17.11 v22.86,17.02 | 19.5,15.43 19.11,15.25 v19.18,15.11 | 19.5,15.43 19.31,15.05 v19.18,15.11
I2S_MCK  (via drill 0.3)
  Top 0.203: 3.49,7.56 3.81,7.87 9.91,7.87 10.54,7.24 24.51,7.24 26.42,9.14 26.42,13.34 25.27,14.48 23.88,14.48 21.97,16.38 19.05,16.38 v18.29,17.14 | 3.49,7.56 v3.17,7.24 | M1.31 4.48,4.31 3.87,4.91 | 3.87,4.91 v3.56,5.23 | 3.87,4.91 3.69,5.3 v3.56,5.23 | 3.87,4.91 3.49,5.1 v3.56,5.23 | 3.49,7.56 3.11,7.37 v3.17,7.24 | 3.49,7.56 3.31,7.17 v3.17,7.24
  Bottom 0.203: 18.29,16.76 R18.2 18.16,17.02 v18.29,17.14 | U4.12 18.29,17.59 | 18.29,17.59 v18.29,17.14 | 3.49,6.92 3.56,6.86 3.56,5.68 | 3.49,6.92 v3.17,7.24 | 3.56,5.68 v3.56,5.23 | 18.29,17.59 18.15,17.19 v18.29,17.14 | 18.29,17.59 18.43,17.19 v18.29,17.14 | 3.56,5.68 3.42,5.28 v3.56,5.23 | 3.56,5.68 3.7,5.28 v3.56,5.23 | 3.49,6.92 3.31,7.3 v3.17,7.24 | 3.49,6.92 3.11,7.11 v3.17,7.24
I2S_MICIN  (via drill 0.3)
  Top 0.203: M1.30 1.98,6.8 3.43,8.26 10.03,8.26 10.67,7.62 24.38,7.62 26.04,9.27 26.04,13.21 25.15,14.1 23.75,14.1 21.84,16 18.67,16 17.27,17.4 16,17.4 15.11,18.29 15.11,20.95 15.84,21.68 | 15.84,21.68 16,21.84 v16,22.1 | 15.84,21.68 16.11,22 v16,22.1 | 15.84,21.68 15.85,22.1 v16,22.1
  Bottom 0.152: U5.6 16.94,23.19
  Bottom 0.203: 16.94,23.19 R19.2 16.76,22.1 16.45,22.1 | v16,22.1 16.45,22.1 | 16.45,22.1 16.05,22.24 v16,22.1 | 16.45,22.1 16.05,21.96 v16,22.1
I2S_SD  (via drill 0.3)
  Top 0.203: 6.48,3.56 M1.32 | 6.28,3.81 M1.32 | v6.48,3.05 6.48,3.5 | 6.48,3.5 M1.32 | 6.48,3.5 6.34,3.1 v6.48,3.05 | 6.48,3.5 6.62,3.1 v6.48,3.05
  Bottom 0.203: SW2.2 2.31,4.8 3.17,3.94 4.06,3.94 4.32,3.68 4.32,2.54 4.45,2.41 5.84,2.41 6.16,2.73 | 6.16,2.73 v6.48,3.05 | 6.16,2.73 6.54,2.91 v6.48,3.05 | 6.16,2.73 6.34,3.11 v6.48,3.05
I2S_WS  (via drill 0.3)
  Top 0.203: M1.33 8.84,4.37 | 8.84,4.37 9.14,4.67 v9.14,4.7 | v9.14,6.22 9.27,6.1 9.58,6.1 | 9.58,6.1 24.89,6.1 27.56,8.76 27.56,13.72 25.65,15.62 24.26,15.62 23.5,16.38 23.5,17.45 23.11,17.83 20.32,17.83 19.58,18.57 19.58,22.96 19.3,23.24 18.8,23.24 18.64,23.39 18.31,23.39 | v17.86,23.39 18.31,23.39 | 8.84,4.37 9.21,4.57 v9.14,4.7 | 8.84,4.37 9.01,4.76 v9.14,4.7 | 9.58,6.1 9.23,6.34 v9.14,6.22 | 9.58,6.1 9.15,6.08 v9.14,6.22 | 18.31,23.39 17.91,23.53 v17.86,23.39 | 18.31,23.39 17.91,23.25 v17.86,23.39
  Bottom 0.203: v9.14,4.7 9.14,5.15 | 9.14,5.15 9.14,5.77 | 9.14,5.77 v9.14,6.22 | 17.54,23.71 17.47,23.78 U5.5 | 17.54,23.71 v17.86,23.39 | 9.14,5.15 9,4.75 v9.14,4.7 | 9.14,5.15 9.28,4.75 v9.14,4.7 | 9.14,5.77 9.28,6.17 v9.14,6.22 | 9.14,5.77 9,6.17 v9.14,6.22 | 17.54,23.71 17.72,23.33 v17.86,23.39 | 17.54,23.71 17.92,23.53 v17.86,23.39
ILIM
  Bottom 0.203: R6.1 11.56,6.1 11.18,5.71 U1.5
IO8  (via drill 0.3)
  Top 0.203: v36.96,27.18 26.42,27.18 25.65,27.94 25.65,29.97 24.13,31.5 J1.10
  Bottom 0.203: v36.96,27.18 36.96,26.73 | 36.96,26.73 36.96,24.89 38.1,23.75 38.1,21.21 38.99,20.32 38.99,16.51 37.72,15.24 U2.28A | 36.96,26.73 37.1,27.13 v36.96,27.18 | 36.96,26.73 36.82,27.13 v36.96,27.18
IO9  (via drill 0.3)
  Top 0.203: v37.59,26.67 36.7,26.67 36.58,26.8 26.24,26.8 25.3,27.74 25.3,29.82 24.64,30.48 22.86,30.48 J1.9
  Bottom 0.203: 37.59,26.22 37.59,24.77 38.48,23.88 38.48,21.34 39.37,20.45 39.37,16.38 38.23,15.24 38.23,14.73 37.94,14.44 U2.29A | 37.59,26.22 v37.59,26.67 | 37.59,26.22 37.73,26.62 v37.59,26.67 | 37.59,26.22 37.45,26.62 v37.59,26.67
IO10  (via drill 0.3)
  Top 0.203: 37.8,26.16 37.34,26.16 37.21,26.29 36.58,26.29 36.45,26.42 25.98,26.42 24.71,27.69 23.87,27.69 | 37.8,26.16 38.1,26.16 v38.23,26.29 | v23.52,27.96 23.8,27.69 23.87,27.69 | 37.8,26.16 38.22,26.14 v38.23,26.29 | 37.8,26.16 38.14,26.41 v38.23,26.29 | 23.87,27.69 23.65,28.05 v23.52,27.96 | 23.87,27.69 23.47,27.82 v23.52,27.96
  Bottom 0.203: 38.23,25.84 38.23,24.64 38.86,24 38.86,21.46 39.75,20.57 39.75,16.26 38.61,15.11 38.61,14.61 38.1,14.1 38.1,13.84 37.9,13.64 U2.30A | 38.23,25.84 v38.23,26.29 | J1.8 19.05,31.62 22.71,27.96 23.07,27.96 | 23.07,27.96 v23.52,27.96 | 38.23,25.84 38.37,26.24 v38.23,26.29 | 38.23,25.84 38.09,26.24 v38.23,26.29 | 23.07,27.96 23.47,27.82 v23.52,27.96 | 23.07,27.96 23.47,28.11 v23.52,27.96
IO11  (via drill 0.3)
  Top 0.203: 27.64,22.74 27.64,23.27 24.94,25.96 24.94,26.92 24.56,27.3 22.1,27.3 21.46,27.94 21.46,29.84 20.93,30.38 17.88,30.38 J1.7 | 27.64,22.74 27.64,22.4 v27.74,22.3 | 27.64,22.74 27.59,22.32 v27.74,22.3 | 27.64,22.74 27.86,22.38 v27.74,22.3
  Bottom 0.203: U2.12A 27.37,21.93 27.42,21.98 | 27.42,21.98 v27.74,22.3 | 27.42,21.98 27.8,22.17 v27.74,22.3 | 27.42,21.98 27.6,22.37 v27.74,22.3
IO12  (via drill 0.3)
  Top 0.203: v37.97,16.76 37.97,18.67 35.43,21.21 27.18,21.21 26.8,21.59 26.8,22.94 24.51,25.22 23.13,25.22 | v22.68,25.22 23.13,25.22 | 23.13,25.22 22.73,25.36 v22.68,25.22 | 23.13,25.22 22.73,25.08 v22.68,25.22
  Bottom 0.203: v37.97,16.76 37.9,16.84 37.53,16.84 | 37.53,16.84 U2.26 | J1.6 14.73,31.75 16,30.48 19.68,30.48 22.48,27.69 22.48,25.62 | 22.48,25.62 22.48,25.43 v22.68,25.22 | 37.53,16.84 37.9,16.63 v37.97,16.76 | 37.53,16.84 37.95,16.91 v37.97,16.76 | 22.48,25.62 22.54,25.2 v22.68,25.22 | 22.48,25.62 22.79,25.33 v22.68,25.22
IO13  (via drill 0.3)
  Top 0.203: v37.97,12.06 37.85,12.06 37.6,12.31 | 37.6,12.31 37.34,12.57 37.34,18.8 35.31,20.83 27.05,20.83 26.42,21.46 26.42,22.68 24.38,24.71 22.38,24.71 21.87,25.22 21.13,25.22 | v20.68,25.22 21.13,25.22 | 37.6,12.31 37.85,11.97 v37.97,12.06 | 37.6,12.31 38.01,12.21 v37.97,12.06 | 21.13,25.22 20.73,25.36 v20.68,25.22 | 21.13,25.22 20.73,25.08 v20.68,25.22
  Bottom 0.203: v37.97,12.06 37.52,12.06 | 37.52,12.06 37.19,12.06 U2.32A | v20.68,25.22 20.68,25.67 | 20.68,25.67 20.68,26.95 18.8,28.83 13.08,28.83 11.43,30.48 10.16,30.48 J1.4 | 37.52,12.06 37.92,11.93 v37.97,12.06 | 37.52,12.06 37.92,12.21 v37.97,12.06 | 20.68,25.67 20.54,25.27 v20.68,25.22 | 20.68,25.67 20.82,25.27 v20.68,25.22
JTAG_TDI  (via drill 0.3)
  Top 0.203: M1.8 26.48,28.39 26.61,28.26 | 26.61,28.26 v26.92,27.94 | 26.61,28.26 26.79,27.88 v26.92,27.94 | 26.61,28.26 26.99,28.07 v26.92,27.94
  Bottom 0.203: v26.92,27.94 26.8,27.94 25.53,26.67 25.53,25.53 23.14,23.14 18.9,23.14 17.56,24.48 U5.4
JTAG_TMS  (via drill 0.3)
  Top 0.203: M1.6 31.35,28.14 | 31.35,28.14 31.37,28.12 v31.37,27.69 | v16.89,19.68 16.89,20.14 | 16.89,20.14 16.89,20.45 17.21,20.76 | 17.21,20.76 v17.53,21.08 | 31.35,28.14 31.23,27.73 v31.37,27.69 | 31.35,28.14 31.51,27.74 v31.37,27.69 | 16.89,20.14 16.75,19.73 v16.89,19.68 | 16.89,20.14 17.03,19.73 v16.89,19.68 | 17.21,20.76 17.59,20.95 v17.53,21.08 | 17.21,20.76 17.39,21.15 v17.53,21.08
  Bottom 0.203: v31.37,27.69 31.24,27.81 28.07,27.81 27.3,27.05 26.92,27.05 26.29,26.42 26.29,25.27 23.44,22.43 19.41,22.43 18.06,21.08 17.98,21.08 | U4.4 17,19.07 16.89,19.18 16.89,19.23 | 16.89,19.23 v16.89,19.68 | v17.53,21.08 17.98,21.08 | 16.89,19.23 17.03,19.64 v16.89,19.68 | 16.89,19.23 16.75,19.64 v16.89,19.68 | 17.98,21.08 17.57,21.22 v17.53,21.08 | 17.98,21.08 17.57,20.94 v17.53,21.08
LED0  (via drill 0.3)
  Top 0.203: 4.57,28.92 M1.19 | 4.57,29.1 4.72,29.1 5.02,29.4 | 5.02,29.4 v5.33,29.72 | 5.02,29.4 5.4,29.58 v5.33,29.72 | 5.02,29.4 5.2,29.78 v5.33,29.72
  Top 0.254: 4.57,29.1 M1.19
  Bottom 0.203: v5.33,29.72 5.33,29.59 5.09,29.34 | 5.09,29.34 R24.2 | 5.09,29.34 5.42,29.6 v5.33,29.72 | 5.09,29.34 5.19,29.75 v5.33,29.72
LED1  (via drill 0.3)
  Top 0.203: M1.18 6.48,27.55 | 6.48,27.55 6.48,27.43 v6.73,27.18 | 6.48,27.55 6.59,27.14 v6.73,27.18 | 6.48,27.55 6.82,27.3 v6.73,27.18
  Top 0.254: M1.18
  Bottom 0.203: R23.2 4.7,23.18 4.7,25.02 6.48,26.8 | 6.48,26.8 6.73,27.05 v6.73,27.18 | 6.48,26.8 6.82,27.06 v6.73,27.18 | 6.48,26.8 6.59,27.21 v6.73,27.18
LED6  (via drill 0.3)
  Top 0.203: 4.97,7.49 9.65,7.49 10.29,6.86 24.64,6.86 26.8,9.02 26.8,13.46 25.4,14.86 24,14.86 22.1,16.76 19.18,16.76 18.8,17.14 18.8,17.4 18.41,17.78 16.13,17.78 15.49,18.41 15.49,20.83 16.51,21.84 16.51,24 17.4,24.89 17.71,24.89 | 4.97,7.49 4.85,7.49 v4.6,7.24 | M1.13 16.48,27.91 | 16.48,27.91 16.48,27.84 v16.76,27.56 | v18.16,24.89 17.71,24.89 | 4.97,7.49 4.56,7.38 v4.6,7.24 | 4.97,7.49 4.72,7.15 v4.6,7.24 | 16.48,27.91 16.62,27.51 v16.76,27.56 | 16.48,27.91 16.84,27.69 v16.76,27.56 | 17.71,24.89 18.11,24.75 v18.16,24.89 | 17.71,24.89 18.11,25.03 v18.16,24.89
  Bottom 0.203: R22.2 5.46,3.66 5.46,5.84 4.6,6.71 4.6,6.79 | 17.08,27.24 17.27,27.05 17.53,27.05 17.91,26.67 18.41,26.67 18.54,26.54 18.54,25.27 18.48,25.21 | 17.08,27.24 v16.76,27.56 | v4.6,7.24 4.6,6.79 | 18.48,25.21 v18.16,24.89 | 4.6,6.79 4.74,7.19 v4.6,7.24 | 4.6,6.79 4.46,7.19 v4.6,7.24 | 17.08,27.24 16.9,27.62 v16.76,27.56 | 17.08,27.24 16.7,27.43 v16.76,27.56 | 18.48,25.21 18.1,25.03 v18.16,24.89 | 18.48,25.21 18.3,24.83 v18.16,24.89
LED7  (via drill 0.3)
  Top 0.203: M1.12 18.48,28.51 17.84,27.88 | 17.84,27.88 v17.53,27.56 | v16,19.05 16,20.83 16.89,21.72 16.89,23.88 17.4,24.38 18.62,24.38 v18.75,24.51 | 17.84,27.88 17.46,27.69 v17.53,27.56 | 17.84,27.88 17.66,27.5 v17.53,27.56
  Bottom 0.203: U4.3 16.76,18.67 16.45,18.99 | 16.45,18.99 16.38,19.05 v16,19.05 | 18.92,24.92 18.92,24.69 v18.75,24.51 | 18.92,24.92 18.92,26.67 18.54,27.05 18.03,27.05 v17.53,27.56 | 16.45,18.99 16.07,19.18 v16,19.05 | 16.45,18.99 16.03,18.9 v16,19.05 | 18.92,24.92 18.64,24.61 v18.75,24.51 | 18.92,24.92 18.89,24.5 v18.75,24.51
LED8  (via drill 0.3)
  Top 0.203: M1.11 20.48,28.1 19.94,27.56 18.74,27.56 | 18.74,27.56 v18.29,27.56 | 16.51,18.72 16.51,19.3 16.38,19.43 16.38,20.7 17.27,21.59 17.27,23.75 17.53,24 18.68,24 | 16.51,18.72 16.51,18.54 16.38,18.41 v16.38,18.29 | v19.05,23.75 18.8,24 18.68,24 | 16.51,18.72 16.26,18.37 v16.38,18.29 | 16.51,18.72 16.53,18.3 v16.38,18.29 | 18.74,27.56 18.34,27.7 v18.29,27.56 | 18.74,27.56 18.34,27.42 v18.29,27.56 | 18.68,24 18.93,23.66 v19.05,23.75 | 18.68,24 19.09,23.89 v19.05,23.75
  Bottom 0.203: U4.2 16.4,18.27 v16.38,18.29 | v18.29,27.56 18.54,27.56 19.3,26.8 19.3,24.12 | 19.3,24.12 19.3,24 v19.05,23.75 | 19.3,24.12 18.96,23.87 v19.05,23.75 | 19.3,24.12 19.19,23.71 v19.05,23.75
MISO  (via drill 0.3)
  Top 0.203: 25.26,19.05 34.42,19.05 35.43,18.03 35.43,6.22 35.69,5.97 40.89,5.97 41.91,4.95 J2.17 | 25.26,19.05 25.15,19.05 v24.89,19.3 | 25.26,19.05 25.01,19.39 v24.89,19.3 | 25.26,19.05 24.85,19.16 v24.89,19.3
  Bottom 0.203: 26.2,19.31 26.27,19.24 | 24.46,19.18 23.5,19.18 22.15,20.52 20.9,20.52 19.45,19.07 U4.8 | 24.46,19.18 24.77,19.18 v24.89,19.3 | U2.11A 25.5,19.3 25.34,19.3 | 25.34,19.3 v24.89,19.3 | 24.46,19.18 24.89,19.16 v24.89,19.3 | 24.46,19.18 24.81,19.43 v24.89,19.3 | 25.34,19.3 24.94,19.44 v24.89,19.3 | 25.34,19.3 24.94,19.16 v24.89,19.3
MOSI  (via drill 0.3)
  Top 0.203: J2.15 37.47,1.91 37.47,5.08 37.08,5.46 35.69,5.46 35.05,6.1 35.05,17.91 34.29,18.67 24.99,18.67 v24.92,18.59
  Bottom 0.203: v24.92,18.59 24.47,18.59 | 24.47,18.59 23.57,18.59 22,20.17 21.08,20.17 19.58,18.67 U4.9 | U2.10A 25.54,18.41 25.33,18.41 | 25.33,18.41 25.09,18.41 v24.92,18.59 | 24.47,18.59 24.87,18.45 v24.92,18.59 | 24.47,18.59 24.87,18.73 v24.92,18.59 | 25.33,18.41 25.02,18.7 v24.92,18.59 | 25.33,18.41 24.91,18.45 v24.92,18.59
N$3
  cutout Bottom: 14.1,8.26 14.1,9.27 13.59,9.27 13.59,8.26
N$5
  Bottom 0.279: U2.3A 24.14,12.84 R2.2
N$8
  Bottom 0.203: U2.33A 38.67,11.24 R4.2
N$9
  Bottom 0.279: U2.4A 24.08,13.64 R3.2
P4_RX+
  Top 0.203: J2.4 9.53,1.27 10.92,2.67 12.83,2.67 14.17,4.01 M1.36
P4_RX-
  Top 0.203: J2.5 12.06,1.27 13.34,2.54 15.01,2.54 M1.37
P4_TX+
  Top 0.203: M1.38 17.01,2.54 15.88,2.54 14.61,1.27 J2.6
P4_TX-
  Top 0.203: M1.39 19.01,2.54 18.41,2.54 17.14,1.27 J2.7
PE
  Bottom 1.016: S1.SH$3 S1.SH$2
  Bottom 1.905: S1.SH$1 S1.SH$3 1.45,20.45 | 1.45,20.45 S1.SH$4 | C1.1 5.59,19.3 4.45,20.45 1.45,20.45
POWER_LED
  Bottom 0.203: D2.2 7.49,10.41 8.51,9.4 8.51,9.27 R20.1
RESET
  Bottom 0.203: Q1.1 5.65,23.18 R14.1 R16.2
RESET_SWITCH
  Bottom 0.254: C30.1 R25.2 53.31,4.47 SW3.1
RXD1  (via drill 0.3)
  Top 0.203: 35.99,22.73 35.69,22.73 v35.56,22.61 | 35.99,22.73 37.47,22.73 44.07,29.34 49.66,29.34 J1.21 | 35.99,22.73 35.57,22.75 v35.56,22.61 | 35.99,22.73 35.65,22.48 v35.56,22.61
  Bottom 0.203: U2.20A 33.78,21.05 33.78,21.97 34.42,22.61 35.11,22.61 | 35.11,22.61 v35.56,22.61 | v35.56,22.61 35.56,23.06 | 35.56,23.06 35.56,23.24 34.54,24.26 34.54,27.3 34.42,27.43 32.38,27.43 31.75,26.8 30.86,26.8 30.61,27.05 28.32,27.05 27.56,26.29 27.18,26.29 27.05,26.16 27.05,24.99 23.77,21.72 19.76,21.72 18.24,20.19 14.35,20.19 13.42,19.26 U6.1 | 35.11,22.61 35.51,22.47 v35.56,22.61 | 35.11,22.61 35.51,22.75 v35.56,22.61 | 35.56,23.06 35.42,22.66 v35.56,22.61 | 35.56,23.06 35.7,22.66 v35.56,22.61
SCK  (via drill 0.3)
  Top 0.203: J2.14 34.29,1.78 35.43,2.92 35.43,5.08 34.67,5.84 34.67,17.78 34.16,18.29 25.65,18.29 25.31,17.95 | v24.13,19.68 24.13,19.23 | 24.13,19.23 24.13,18.54 24.57,18.1 | 24.57,18.1 v24.89,17.78 | v24.89,17.78 25.15,17.78 25.31,17.95 | 24.57,18.1 24.76,17.72 v24.89,17.78 | 24.57,18.1 24.96,17.91 v24.89,17.78 | 25.31,17.95 24.89,17.93 v24.89,17.78 | 25.31,17.95 24.99,17.67 v24.89,17.78 | 24.13,19.23 24.27,19.64 v24.13,19.68 | 24.13,19.23 23.99,19.64 v24.13,19.68
  Bottom 0.203: U2.9A 25.32,17.64 | 25.32,17.64 25.03,17.64 v24.89,17.78 | U4.7 19.34,19.47 20.75,20.88 22.3,20.88 23.62,19.56 23.7,19.56 | 23.7,19.56 24,19.56 v24.13,19.68 | 25.32,17.64 24.98,17.9 v24.89,17.78 | 25.32,17.64 24.89,17.63 v24.89,17.78 | 23.7,19.56 24.12,19.54 v24.13,19.68 | 23.7,19.56 24.04,19.81 v24.13,19.68
SCL  (via drill 0.3)
  Top 0.203: v32.26,22.48 32.38,22.61 33.27,22.61 34.92,24.26 36.96,24.26 39.62,26.92 39.62,29.84 41.53,31.75 J1.17
  Bottom 0.203: 32.26,21.13 32,21.38 | v32.26,22.48 32.17,22.39 32.17,22.04 | 32.17,22.04 U2.18A | 32.17,22.04 32.39,22.4 v32.26,22.48 | 32.17,22.04 32.11,22.46 v32.26,22.48
  Bottom 0.254: 32.26,21.13 U2.18A
SDA  (via drill 0.3)
  Top 0.203: 33.47,21.78 35.18,23.5 37.21,23.5 43.81,30.1 45.34,30.1 J1.19 | 33.47,21.78 33.4,21.72 v33.02,21.72 | 33.47,21.78 33.05,21.86 v33.02,21.72 | 33.47,21.78 33.09,21.59 v33.02,21.72
  Bottom 0.203: v33.02,21.72 32.97,21.67 32.97,21.27 | 32.97,21.27 U2.19A | 32.97,21.27 33.15,21.65 v33.02,21.72 | 32.97,21.27 32.88,21.68 v33.02,21.72
SPDIF_OUT  (via drill 0.3)
  Top 0.203: M1.29 2.92,8.51 3.05,8.64 10.16,8.64 10.79,8 24.26,8 25.65,9.4 25.65,13.08 25.02,13.72 23.62,13.72 21.72,15.62 18.54,15.62 17.14,17.02 15.88,17.02 15.11,17.78 10.54,17.78 10.16,18.16 10.16,22.81 | v10.03,23.24 10.16,23.11 10.16,22.81 | 10.16,22.81 10.18,23.23 v10.03,23.24 | 10.16,22.81 9.91,23.16 v10.03,23.24
  Bottom 0.203: R17.2 10.03,23.75 10.03,23.69 | 10.03,23.69 v10.03,23.24 | 10.03,23.69 9.89,23.29 v10.03,23.24 | 10.03,23.69 10.17,23.29 v10.03,23.24
SS  (via drill 0.3)
  Top 0.203: 25.08,17.21 25.78,17.91 34.04,17.91 34.29,17.65 34.29,5.84 33.53,5.08 33.53,3.37 | 25.08,17.21 v24.77,16.89 | v33.53,2.92 33.53,3.37 | 33.53,3.37 33.39,2.97 v33.53,2.92 | 33.53,3.37 33.67,2.97 v33.53,2.92 | 25.08,17.21 24.7,17.02 v24.77,16.89 | 25.08,17.21 24.9,16.83 v24.77,16.89
  Bottom 0.203: 33.98,2.92 37.72,2.92 J2.16 | 33.98,2.92 v33.53,2.92 | v24.77,16.89 25.21,16.89 | 25.21,16.89 25.52,16.89 U2.8A | U4.10 19.69,18.27 21.23,19.81 21.84,19.81 24.45,17.21 | 24.45,17.21 v24.77,16.89 | 33.98,2.92 33.58,3.06 v33.53,2.92 | 33.98,2.92 33.58,2.78 v33.53,2.92 | 25.21,16.89 24.81,17.03 v24.77,16.89 | 25.21,16.89 24.81,16.75 v24.77,16.89 | 24.45,17.21 24.63,16.83 v24.77,16.89 | 24.45,17.21 24.83,17.02 v24.77,16.89
SW
  pour Bottom (no thermals): 14.27,9.42 16.79,9.42 17.14,9.78 17.14,10.54 15.34,10.54 15.34,9.91 15.09,9.65 14.27,9.65
TXD1  (via drill 0.3)
  Top 0.203: 34.54,22.29 34.54,22.35 35.31,23.11 37.34,23.11 43.94,29.72 47.5,29.72 J1.20 | 34.54,22.29 v34.54,21.84 | 34.54,22.29 34.4,21.89 v34.54,21.84 | 34.54,22.29 34.68,21.89 v34.54,21.84
  Bottom 0.203: U2.21A 34.54,21.07 34.54,21.39 | U6.8 13.58,20.57 18.06,20.57 19.56,22.07 23.6,22.07 26.67,25.15 26.67,26.29 27.05,26.67 27.43,26.67 28.19,27.43 30.86,27.43 31.11,27.18 31.62,27.18 32.26,27.81 34.54,27.81 34.92,27.43 34.92,24.38 36.07,23.24 36.07,22.35 35.81,22.1 35,22.1 34.95,22.05 | 34.54,21.39 v34.54,21.84 | v34.54,21.84 34.75,21.84 34.95,22.05 | 34.54,21.39 34.68,21.8 v34.54,21.84 | 34.54,21.39 34.4,21.8 v34.54,21.84 | 34.95,22.05 34.52,21.99 v34.54,21.84 | 34.95,22.05 34.65,21.74 v34.54,21.84
UART_EN
  Bottom 0.203: R15.1 R17.1 10.46,24.89 Q2.1
UART_RTS  (via drill 0.3)
  Top 0.203: M1.55 40.26,16.51 38.73,18.03 38.73,20.57 37.85,21.46 36.83,21.46 36.77,21.53 | v36.45,21.84 36.77,21.53 | v17.8,21.69 18.03,21.46 18.03,20.83 17.65,20.45 17.65,20.14 | 17.65,20.14 v17.65,19.68 | 36.77,21.53 36.58,21.91 v36.45,21.84 | 36.77,21.53 36.38,21.71 v36.45,21.84 | 17.65,20.14 17.51,19.73 v17.65,19.68 | 17.65,20.14 17.79,19.73 v17.65,19.68
  Bottom 0.203: 36.45,22.29 36.45,23.37 35.31,24.51 35.31,27.56 34.67,28.19 27.94,28.19 27.18,27.43 26.8,27.43 25.91,26.54 25.91,25.4 23.29,22.78 19.2,22.78 18.24,21.82 | 36.45,22.29 v36.45,21.84 | U4.5 17.56,19.47 17.65,19.56 v17.65,19.68 | v17.8,21.69 18.11,21.69 18.24,21.82 | 36.45,22.29 36.31,21.89 v36.45,21.84 | 36.45,22.29 36.59,21.89 v36.45,21.84 | 18.24,21.82 17.81,21.84 v17.8,21.69 | 18.24,21.82 17.89,21.57 v17.8,21.69
UART_RX  (via drill 0.3)
  Top 0.203: 6.91,26.16 3.33,26.16 2.98,26.51 M1.20 | 6.91,26.16 6.93,26.16 v7.24,25.86 | 6.91,26.16 7.11,25.79 v7.24,25.86 | 6.91,26.16 7.3,25.99 v7.24,25.86
  Bottom 0.203: U6.5 11.2,20.73 7.54,24.38 7.54,25.53 | 7.54,25.53 7.54,25.55 v7.24,25.86 | 7.54,25.53 7.38,25.92 v7.24,25.86 | 7.54,25.53 7.17,25.73 v7.24,25.86
UART_TX  (via drill 0.3)
  Top 0.203: 1.98,24.84 M1.21 2.16,24.51 3.3,25.65 5.72,25.65 | v6.17,25.65 5.72,25.65 | 5.72,25.65 6.12,25.51 v6.17,25.65 | 5.72,25.65 6.12,25.79 v6.17,25.65
  Bottom 0.203: U6.4 11.47,18.75 10.92,19.3 10.92,20.45 7.11,24.26 7.11,25.15 6.62,25.64 | v6.17,25.65 6.6,25.65 6.62,25.64 | 6.62,25.64 6.23,25.79 v6.17,25.65 | 6.62,25.64 6.22,25.51 v6.17,25.65
UCAP
  Bottom 0.203: U2.6A C13.2
USB_N
  Top 0.279: 43,10.51 43.76,11.27 44.04,11.27 49.19,6.12 49.19,4.59 50.56,3.22 50.56,2.41 50.56,2.32 50.56,2.31 J2.20
  Top 0.381: M1.52 43,10.51
USB_P
  Top 0.279: M1.53 43.77,11.72 44.23,11.72 49.64,6.3 49.64,4.78 51.03,3.38 51.03,2.31 J2.21
VBUS
  pour Bottom (no thermals): 3.43,15.42 6.27,15.42 6.25,13.13 6.63,12.75 7.16,12.75 7.14,11.56 3.43,11.56
VIN
  pour Bottom (no thermals): 7.11,9.65 7.11,8.76 7.37,8.51 7.37,4.95 8.64,4.95 8.64,4.45 5.97,4.45 5.97,8.38 5.59,8.76 5.59,9.65
XTAL1
  Bottom 0.203: U2.17A R5.2 31.37,23.5 Y1.1 C6.2
XTAL2
  Bottom 0.203: Y1.3 29.72,25.65 30.61,24.77 R5.1 30.61,21.04
  Bottom 0.254: U2.16A 30.61,21.04 | C7.2 Y1.3

## Text on the board
tPlace: Rev.
bPlace: GND | AREF | GP6 | 13 | +5V | 12 | 11~ | 10~ | 9~ | 8 | 7 | GND | 3.3V | 6~ | 5~ | 4 | 3~ | RESET | 2 | TX->1 | RX<-0 | GND | DIGITAL (PWM~) | c 2014-2015, Domino Team / All rights reserved. | Licensed under a / Creative Commons / Attribution-Share- / Alike Unported License. / See creativecommons.org/ / licenses/by-sa/4.0/ | Rev. | ETH_P4 | ICSP | USB | ANALOG / IN | GND | TX- | 2V | A2 | A3 | A4 | A5 | 3.3V | SCK | MOSI | SS | MISO | GND | 5V | USB- | USB+ | GND | A0 | A1 | RX+ | RX- | TX+
Document: DRILL CHART: TOP TO BOTTOM | LINE WIDTH IMPEDANCE CHART FOR REFERENCE | Class | RF | Type | Coated Coplanar Waveguide With Ground 1B | Layer | Impedance | Trace Width | Trace Separation | Ground Separation | TOP, / BOTTOM | 50 Ohms | 14 mils | N/A | 6 mils | Class | USB | Type | Diff Coated Coplanar Waveguide With Ground 1B | Layer | Impedance | Trace Width | Trace Separation | Ground Separation | TOP, / BOTTOM | 90 Ohms | 11 mils | 6 mils | 6 mils | Class | Ethernet | Type | Diff Coated Coplanar Waveguide With Ground 1B | Layer | Impedance | Trace Width | Trace Separation | Ground Separation | TOP, / BOTTOM | 100 Ohms | 8 mils | 6 mils | 6 mils | STACK-UP FOR REFERENCE | LAYER 1 L1 TOP | 18 UM CU + 18 UM PLATING (35 UM) | PREPREG | 0.132 MM PREPREG FR-4 | LAYER 2 L2 GND | 35 UM COPPER | 1.00 MM+/-10% | CORE | 0.6 MM CORE FR-4 LG 135 INC. COP. | LAYER 3 L15 GND | 35 UM COPPER | PREPREG | 0.132 MM PREPREG FR-4 | LAYER 4 L16 BOTTOM | 18 UM CU + 18 UM PLATING (35 UM) | NOTES: | 1. PRINTED CIRCUIT BOARD MADE FROM NEMA GRADE FR-4 TG 135 EPOXY / LAMINATE WITH 18 UM COPPER PLATING AND 1 MM THICKNESS. | 2. ALL DIMENSIONS ARE GIVEN IN MILLIMETERS EXCEPT TRACE WIDTH/SPACE. | 3. CIRCUIT PATHS ARE FOR REFERENCE ONLY. | 4. HOLE SIZES SHOWN ARE FINISHED DIAMETERS AFTER PLATING. | 5. BOARD PLATED USING REFLOW OR SIMILAR METHOD. | 6. BOARD TO HAVE WHITE SOLDER MASK ON PLATED SURFACES USING WET / FILM SR100 OR SR1010 EPOXY. / EQUIVALENT WET OR DRY FILM MAY BE USED. | 7. SILKSCREEN BOARD USING BLACK INK. DISTORTION OF SILKSCREEN / IS ACCEPTABLE OVER TRACES. EPOXY INK ON PLATED LANDS IS NOT / ACCEPTABLE | 8. THE FOLLOWING INFORMATION APPLIES TO THIS BOARD: | * 4 COPPER LAYERS | * 1 MM BOARD THICKNESS | * REQUIRES TOP AND BOTTOM SIDE SILKSCREENS | © 2014-2015, The Domino Team. / All rights reserved. | Licensed under a Creative Commons / Attribution-Share-Alike Unported License. / See creativecommons.org/licenses/by-sa/4.0/ | Reference designs are provided "AS IS" and "WITH ALL FAULTS". / The Domino Team disclaims all other warranties express or implied, / regarding this product, including but not limited to, any implied warranties of / merchantibility or fitness for any particular application. | The Domino Team may make changes to specifications and product descriptions / at any time, without notice. | Rev.
DrillLegend: LAYER-STACK
DrillLegend_01-16: 01-16
DrillLegend_01-20: 01-20
Pinout: DIGITAL (PWM~) | GND | AREF | GP6 | 13 | +5V | 12 | 11~ | 10~ | 9~ | 8 | 7 | GND | 3.3V | 6~ | 5~ | 4 | 3~ | RESET | 2 | TX -> 1 | RX <- 0 | GND | A0 | A1 | GND | P4_RX+ | P4_RX- | P4_TX+ | P4_TX- | 2V | A2 | A3 | A4 | A5 | 3.3V | SCK | MOSI | SS | MISO | GND | 5V | USB- | USB+ | GND | ANALOG IN | Ethernet | ANALOG IN | ICSP | USB | Pinout (.PIN)
Component_side: Component Side (.CMP)
Solder_side: Solder side (.SOL)
Silk_screen_CMP: Silk screen CMP (.PLC)
Silk_screen_SOL: Silk screen SOL (.PLS)
Solder_stop_mask_CMP: Solder stop mask CMP (.STC)
Solder_stop_mask_SOL: Solder stop mask SOL (.STS)
Cream_frame_CMP: Cream frame CMP (.CRC)
Cream_frame_SOL: Cream frame SOL (.CRS)
Drill_data: Drill data (.DRD)
Component_Assembly_CMP: Component Assembly CMP (.ASC)
Component_Assembly_SOL: Component Assembly SOL (.ASS)
Outline: Outline (.OLN)